# EAGLE schematic circuitPendulum4TIA00 (EAGLE 6.6.0)
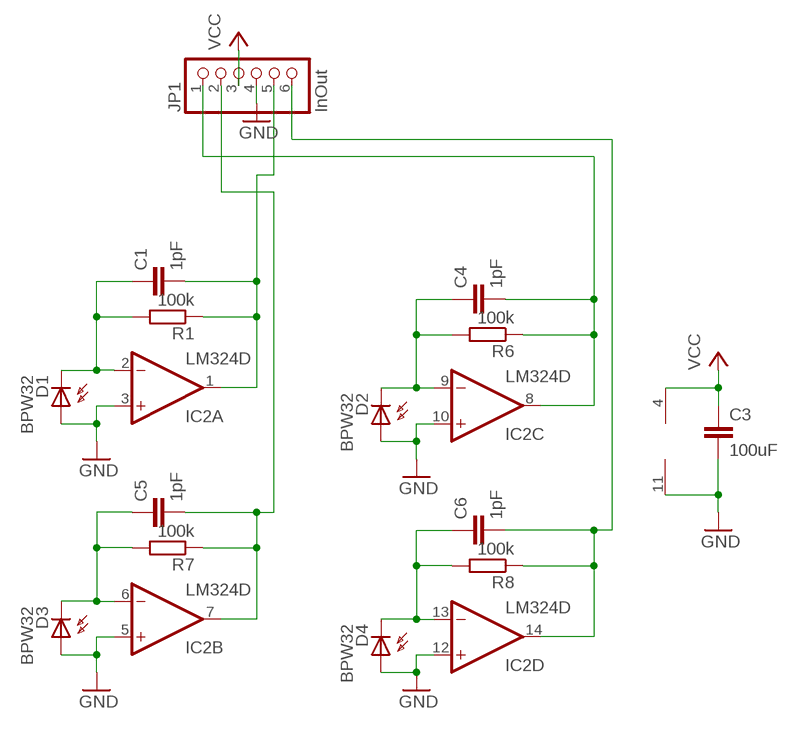
[diagram p0: schematic, sheet 1]

## Parts
C1  1pF  C-EUC0603  [C0603]
C3  100uF  C-EUC0603  [C0603]
C4  1pF  C-EUC0603  [C0603]
C5  1pF  C-EUC0603  [C0603]
C6  1pF  C-EUC0603  [C0603]
D1  BPW32  [BPW32]
D2  BPW32  [BPW32]
D3  BPW32  [BPW32]
D4  BPW32  [BPW32]
IC2  LM324D  [SO14]
JP1  InOut  PINHD-1X6_2.00  [1X06M]
R1  100k  R-EU_R0603  [R0603]
R6  100k  R-EU_R0603  [R0603]
R7  100k  R-EU_R0603  [R0603]
R8  100k  R-EU_R0603  [R0603]

## Nets
GND: C3.2 D1.A D2.A D3.A D4.A IC2.3(A:+IN) IC2.5(B:+IN) IC2.10(C:+IN) IC2.11(P:V-) IC2.12(D:+IN) JP1.4
N$7: C4.2 IC2.8(C:OUT) JP1.1 R6.1
N$8: C1.1 D1.K(C) IC2.2(A:-IN) R1.2
N$9: C5.1 D3.K(C) IC2.6(B:-IN) R7.2
N$10: C5.2 IC2.7(B:OUT) JP1.2 R7.1
N$11: C1.2 IC2.1(A:OUT) JP1.5 R1.1
N$12: C6.2 IC2.14(D:OUT) JP1.6 R8.1
N$13: C6.1 D4.K(C) IC2.13(D:-IN) R8.2
N$14: C4.1 D2.K(C) IC2.9(C:-IN) R6.2
VCC: C3.1 IC2.4(P:V+) JP1.3

## Library data of the parts
C1 C3-C6 = resistor:C-EU: CAPACITOR, European symbol
D1-D4 = opto-trans-siemens:BPW32: PHOTO DIODE; OC_FARNELL: unknown; OC_NEWARK: unknown
IC2 = linear:LM324: OP AMP
JP1 = pinhead1:PINHD-1X6: PIN HEADER
R1 R6-R8 = resistor:R-EU_: RESISTOR, European symbol